# Altium schematic sheet Method.SchDoc
size A2
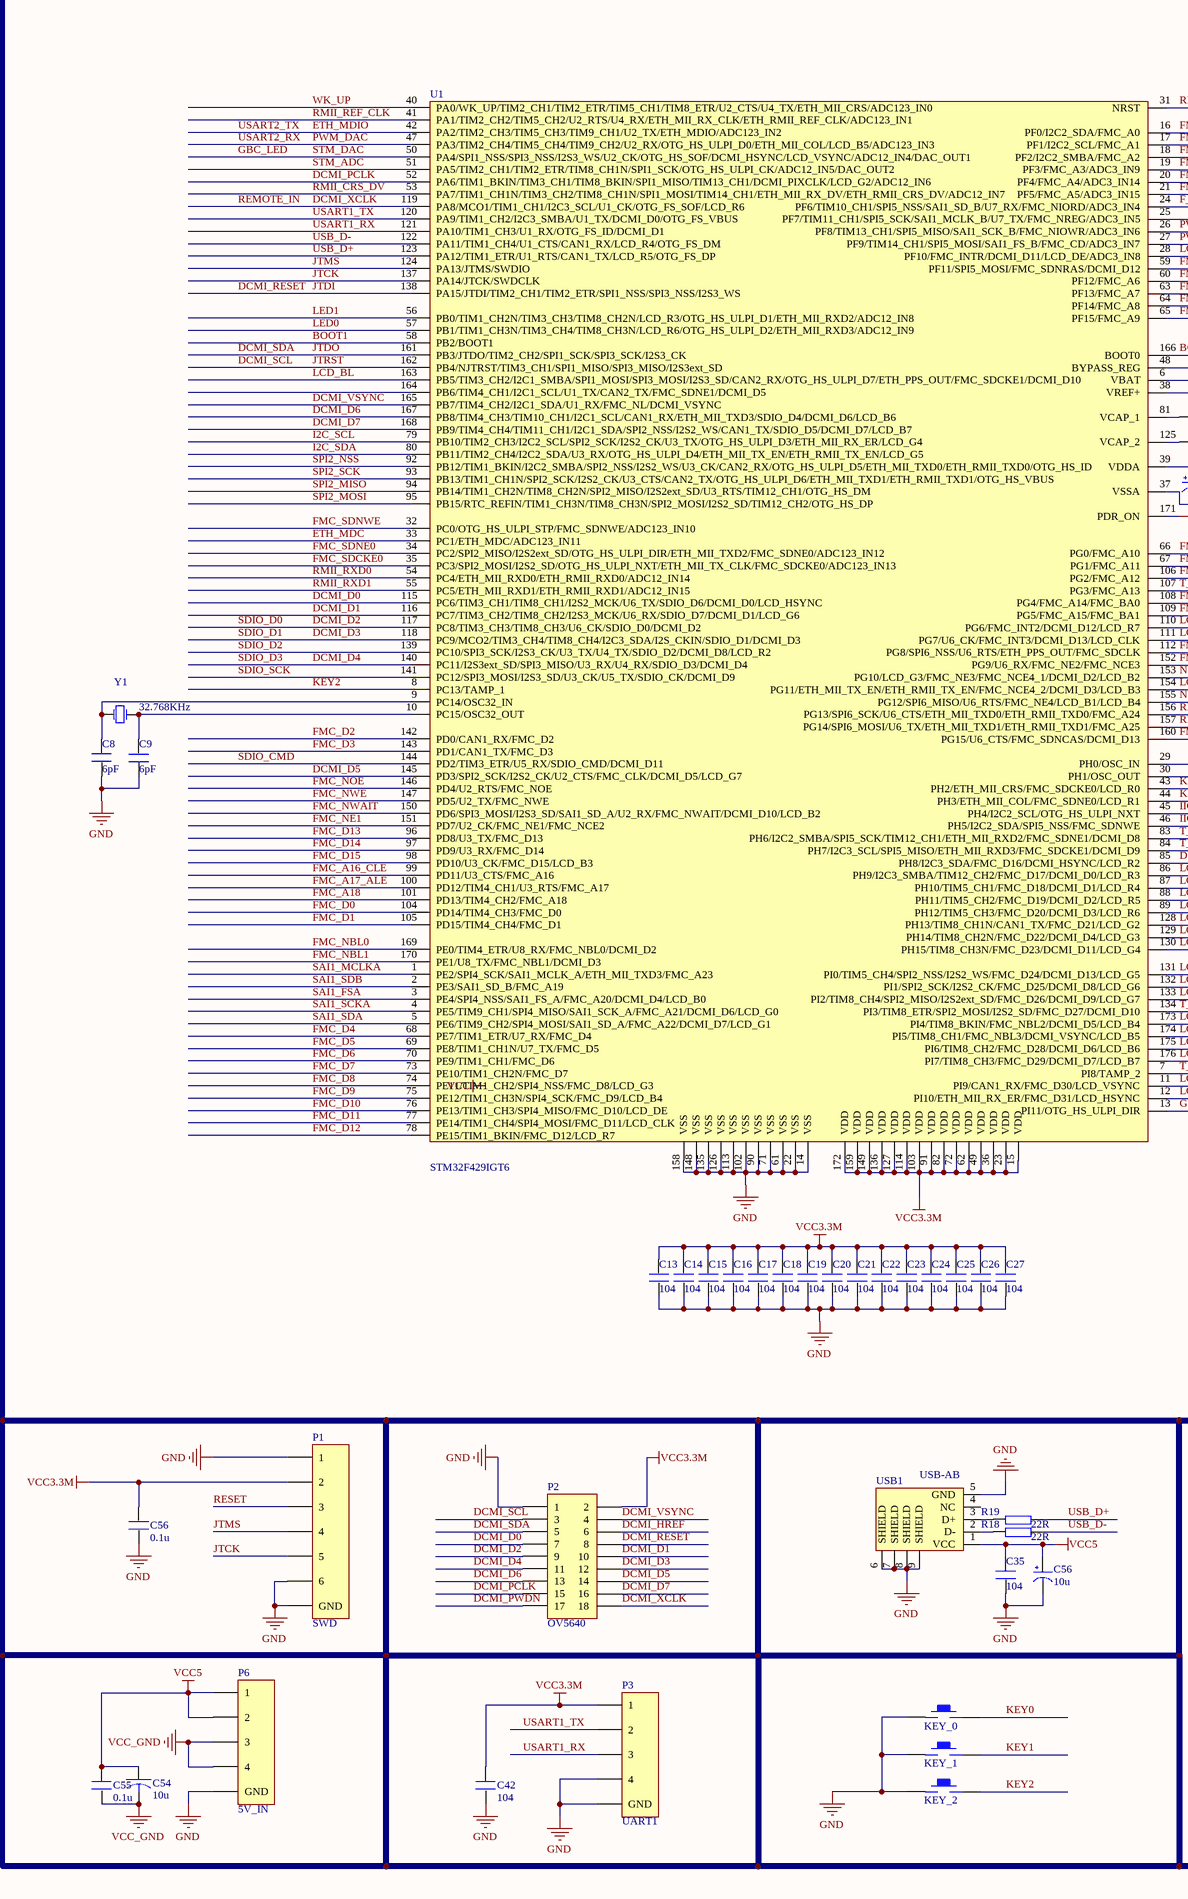
[diagram p0: Method.SchDoc, left]
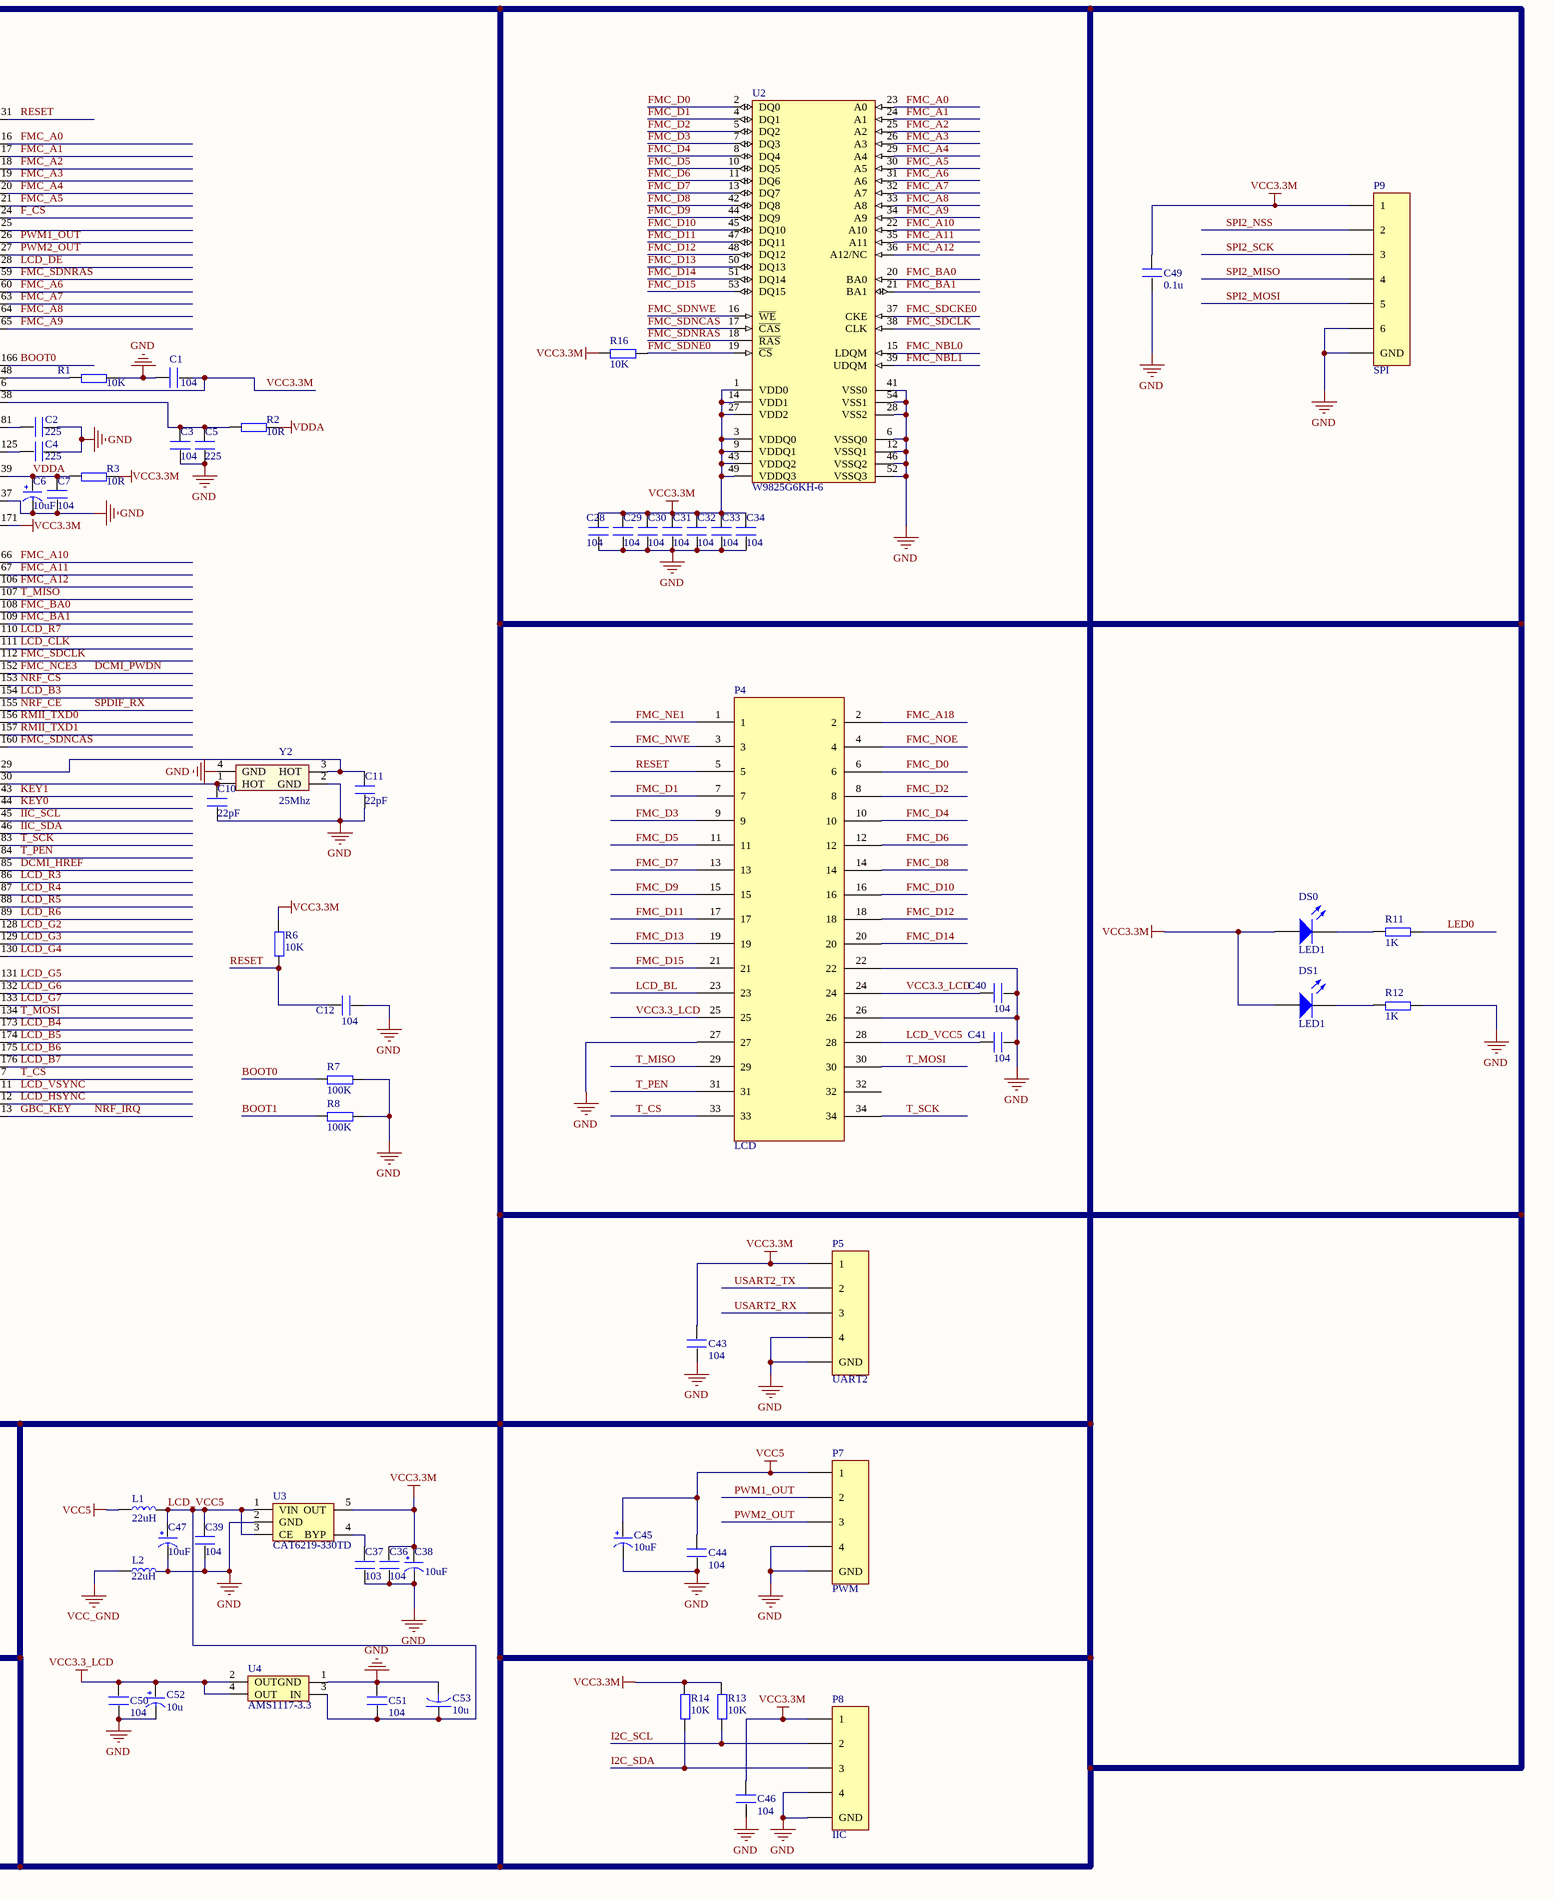
[diagram p1: Method.SchDoc, right]

## Parts
(Parts that share a designator on the sheet are numbered #1, #2 ... from top to bottom, then left to right.)
C1  104  [0603P]
C2  225  [0603P]
C3  104  [0603P]
C4  225  [0603P]
C5  225  [0603P]
C6  10uF  [CAP_D1]
C7  104  [0603P]
C8  6pF  [0603P]
C9  6pF  [0603P]
C10  22pF  [0603P]
C11  22pF  [0603P]
C12  104  [0603P]
C13  104  [0603P]
C14  104  [0603P]
C15  104  [0603P]
C16  104  [0603P]
C17  104  [0603P]
C18  104  [0603P]
C19  104  [0603P]
C20  104  [0603P]
C21  104  [0603P]
C22  104  [0603P]
C23  104  [0603P]
C24  104  [0603P]
C25  104  [0603P]
C26  104  [0603P]
C27  104  [0603P]
C28  104  [0603P]
C29  104  [0603P]
C30  104  [0603P]
C31  104  [0603P]
C32  104  [0603P]
C33  104  [0603P]
C34  104  [0603P]
C35  104  [0603P]
C36  104  [0603P]
C37  103  [0603P]
C38  10uF  [CAP_D1]
C39  104  [0603P]
C40  104  [0603P]
C41  104  [0603P]
C42  104  [0603P]
C43  104  [0603P]
C44  104  [0603P]
C45  10uF  [CAP_D1]
C46  104  [0603P]
C47  10uF  [CAP_D1]
C49  0.1u  [0603P]
C50  104  [0603P]
C51  104  [0603P]
C52  10u  [CAP_D1]
C53  10u  [CAP_D1]
C54  10u  [CAP_D1]
C55  0.1u  [0603P]
C56#1  0.1u  [0603P]
C56#2  10u  [CAP_D1]
DS0  LED1  [SMDLED]
DS1  LED1  [SMDLED]
KEY_0  KEY_M  [KEY_M]  (value not drawn)
KEY_1  KEY_M  [KEY_M]  (value not drawn)
KEY_2  KEY_M  [KEY_M]  (value not drawn)
L1  22uH  [L0805]
L2  22uH  [L0805]
P1  SWD  [FFCH6PIN]
P2  OV5640  [HDR2X9]
P3  UART1  [FFCH4PIN]
P4  LCD  [HDR2X17]
P5  UART2  [FFCH4PIN]
P6  5V_IN  [FFCH4PIN]
P7  PWM  [FFCH4PIN]
P8  IIC  [FFCH4PIN]
P9  SPI  [FFCH6PIN]
R1  10K  [0603P]
R2  10R  [0603P]
R3  10R  [0603P]
R6  10K  [0603P]
R7  100K  [0603P]
R8  100K  [0603P]
R11  1K  [0603P]
R12  1K  [0603P]
R13  10K  [0603P]
R14  10K  [0603P]
R16  10K  [0603P]
R18  22R  [0603P]
R19  22R  [0603P]
U1  STM32F429IGT6  [LQFP176]
U2  W9825G6KH-6  [TSOP54]
U3  CAT6219-330TD  [SOT-23-5]
U4  AMS1117-3.3  [AMS1117]
USB1  USB-AB  [USB_AB]
Y1  32.768KHz  [XTAL3215]
Y2  25Mhz  [XTAL3225]

## Nets
GND: C1.1 C2.1 C3.1 C4.1 C5.1 C6.2(GND) C7.1 C8.1 C9.2 C10.1 C11.1 C12.2 C13.1 C14.1 C15.1 C16.1 C17.1 C18.1 C19.1 C20.1 C21.1 C22.1 C23.1 C24.1 C25.1 C26.1 C27.1 C28.1 C29.1 C30.1 C31.1 C32.1 C33.1 C34.1 C35.1 C36.1 C37.1 C38.2(GND) C39.1 C40.2 C41.2 C42.1 C43.1 C44.1 C45.2(GND) C46.1 C47.2(GND) C49.1 C50.2 C51.1 C52.2(GND) C53.2 C56#1.1 C56#2.2(GND) KEY_0.1 KEY_1.1 KEY_2.1 L2.2 P1.0(GND) P1.1 P1.6 P2.1 P3.0(GND) P3.4 P4.22 P4.26 P4.27 P5.0(GND) P5.4 P6.0(GND) P7.0(GND) P7.4 P8.0(GND) P8.4 P9.0(GND) P9.6 R1.2 R7.2 R8.2 R12.2 U1.14(VSS) U1.22(VSS) U1.37(VSSA) U1.61(VSS) U1.71(VSS) U1.90(VSS) U1.102(VSS) U1.113(VSS) U1.126(VSS) U1.135(VSS) U1.148(VSS) U1.158(VSS) U2.6(VSSQ0) U2.12(VSSQ1) U2.28(VSS2) U2.41(VSS0) U2.46(VSSQ2) U2.52(VSSQ3) U2.54(VSS1) U3.2(GND) U4.1(GND) USB1.5(GND) USB1.6(SHIELD) USB1.7(SHIELD) USB1.8(SHIELD) USB1.9(SHIELD) Y2.2(GND) Y2.4(GND)
VCC3.3_LCD: C40.1 C50.1 C52.1(VCC) P4.24 P4.25 U4.2(OUT) U4.4(OUT)
VCC3.3M: C1.2 C13.2 C14.2 C15.2 C16.2 C17.2 C18.2 C19.2 C20.2 C21.2 C22.2 C23.2 C24.2 C25.2 C26.2 C27.2 C28.2 C29.2 C30.2 C31.2 C32.2 C33.2 C34.2 C36.2 C38.1(VCC) C42.2 C43.2 C46.2 C49.2 C56#1.2 DS0.1(A) DS1.1(A) P1.2 P2.2 P3.1 P5.1 P8.1 P9.1 R3.2 R6.2 R13.2 R14.2 R16.1 U1.6(VBAT) U1.15(VDD) U1.23(VDD) U1.36(VDD) U1.49(VDD) U1.62(VDD) U1.72(VDD) U1.82(VDD) U1.91(VDD) U1.103(VDD) U1.114(VDD) U1.127(VDD) U1.136(VDD) U1.149(VDD) U1.159(VDD) U1.171(PDR_ON) U1.172(VDD) U2.1(VDD0) U2.3(VDDQ0) U2.9(VDDQ1) U2.14(VDD1) U2.27(VDD2) U2.43(VDDQ2) U2.49(VDDQ3) U3.5(OUT)
VCC5: C35.2 C44.2 C45.1(VCC) C54.1 C55.2 C56#2.1(VCC) L1.1 P6.1 P6.2 P7.1 USB1.1(VCC)
VCC_GND: C54.2 C55.1 L2.1 P6.3 P6.4
VDDA: C6.1(VCC) C7.2 R2.2 R3.1 U1.39(VDDA)
BOOT0: R7.1 U1.166(BOOT0)
BOOT1: R8.1 U1.58(PB2/BOOT1)
DCMI_D0: P2.7 U1.115(PC6/TIM3_CH1/TIM8_CH1/I2S2_MCK/U6_TX/SDIO_D6/DCMI_D0/LCD_HSYNC)
DCMI_D1: P2.10 U1.116(PC7/TIM3_CH2/TIM8_CH2/I2S3_MCK/U6_RX/SDIO_D7/DCMI_D1/LCD_G6)
DCMI_D2: P2.9 U1.117(PC8/TIM3_CH3/TIM8_CH3/U6_CK/SDIO_D0/DCMI_D2)  [also labelled SDIO_D0]
DCMI_D3: P2.12 U1.118(PC9/MCO2/TIM3_CH4/TIM8_CH4/I2C3_SDA/I2S_CKIN/SDIO_D1/DCMI_D3)  [also labelled SDIO_D1]
DCMI_D4: P2.11 U1.140(PC11/I2S3ext_SD/SPI3_MISO/U3_RX/U4_RX/SDIO_D3/DCMI_D4)  [also labelled SDIO_D3]
DCMI_D5: P2.14 U1.145(PD3/SPI2_SCK/I2S2_CK/U2_CTS/FMC_CLK/DCMI_D5/LCD_G7)
DCMI_D6: P2.13 U1.167(PB8/TIM4_CH3/TIM10_CH1/I2C1_SCL/CAN1_RX/ETH_MII_TXD3/SDIO_D4/DCMI_D6/LCD_B6)
DCMI_D7: P2.16 U1.168(PB9/TIM4_CH4/TIM11_CH1/I2C1_SDA/SPI2_NSS/I2S2_WS/CAN1_TX/SDIO_D5/DCMI_D7/LCD_B7)
DCMI_HREF: P2.6 U1.85(PH8/I2C3_SDA/FMC_D16/DCMI_HSYNC/LCD_R2)
DCMI_PCLK: P2.15 U1.52(PA6/TIM1_BKIN/TIM3_CH1/TIM8_BKIN/SPI1_MISO/TIM13_CH1/DCMI_PIXCLK/LCD_G2/ADC12_IN6)
DCMI_PWDN: P2.17 U1.152(PG9/U6_RX/FMC_NE2/FMC_NCE3)  [also labelled FMC_NCE3]
DCMI_RESET: P2.8 U1.138(PA15/JTDI/TIM2_CH1/TIM2_ETR/SPI1_NSS/SPI3_NSS/I2S3_WS)  [also labelled JTDI]
DCMI_SCL: P2.3 U1.162(PB4/NJTRST/TIM3_CH1/SPI1_MISO/SPI3_MISO/I2S3ext_SD)  [also labelled JTRST]
DCMI_SDA: P2.5 U1.161(PB3/JTDO/TIM2_CH2/SPI1_SCK/SPI3_SCK/I2S3_CK)  [also labelled JTDO]
DCMI_VSYNC: P2.4 U1.165(PB7/TIM4_CH2/I2C1_SDA/U1_RX/FMC_NL/DCMI_VSYNC)
DCMI_XCLK: P2.18 U1.119(PA8/MCO1/TIM1_CH1/I2C3_SCL/U1_CK/OTG_FS_SOF/LCD_R6)  [also labelled REMOTE_IN]
ETH_MDC: U1.33(PC1/ETH_MDC/ADC123_IN11)
ETH_MDIO: P5.2 U1.42(PA2/TIM2_CH3/TIM5_CH3/TIM9_CH1/U2_TX/ETH_MDIO/ADC123_IN2)  [also labelled USART2_TX]
F_CS: U1.24(PF6/TIM10_CH1/SPI5_NSS/SAI1_SD_B/U7_RX/FMC_NIORD/ADC3_IN4)
FMC_A0: U1.16(PF0/I2C2_SDA/FMC_A0) U2.23(A0)
FMC_A1: U1.17(PF1/I2C2_SCL/FMC_A1) U2.24(A1)
FMC_A2: U1.18(PF2/I2C2_SMBA/FMC_A2) U2.25(A2)
FMC_A3: U1.19(PF3/FMC_A3/ADC3_IN9) U2.26(A3)
FMC_A4: U1.20(PF4/FMC_A4/ADC3_IN14) U2.29(A4)
FMC_A5: U1.21(PF5/FMC_A5/ADC3_IN15) U2.30(A5)
FMC_A6: U1.60(PF12/FMC_A6) U2.31(A6)
FMC_A7: U1.63(PF13/FMC_A7) U2.32(A7)
FMC_A8: U1.64(PF14/FMC_A8) U2.33(A8)
FMC_A9: U1.65(PF15/FMC_A9) U2.34(A9)
FMC_A10: U1.66(PG0/FMC_A10) U2.22(A10)
FMC_A11: U1.67(PG1/FMC_A11) U2.35(A11)
FMC_A12: U1.106(PG2/FMC_A12) U2.36(A12/NC)
FMC_A16_CLE: U1.99(PD11/U3_CTS/FMC_A16)
FMC_A17_ALE: U1.100(PD12/TIM4_CH1/U3_RTS/FMC_A17)
FMC_A18: P4.2 U1.101(PD13/TIM4_CH2/FMC_A18)
FMC_BA0: U1.108(PG4/FMC_A14/FMC_BA0) U2.20(BA0)
FMC_BA1: U1.109(PG5/FMC_A15/FMC_BA1) U2.21(BA1)
FMC_D0: P4.6 U1.104(PD14/TIM4_CH3/FMC_D0) U2.2(DQ0)
FMC_D1: P4.7 U1.105(PD15/TIM4_CH4/FMC_D1) U2.4(DQ1)
FMC_D2: P4.8 U1.142(PD0/CAN1_RX/FMC_D2) U2.5(DQ2)
FMC_D3: P4.9 U1.143(PD1/CAN1_TX/FMC_D3) U2.7(DQ3)
FMC_D4: P4.10 U1.68(PE7/TIM1_ETR/U7_RX/FMC_D4) U2.8(DQ4)
FMC_D5: P4.11 U1.69(PE8/TIM1_CH1N/U7_TX/FMC_D5) U2.10(DQ5)
FMC_D6: P4.12 U1.70(PE9/TIM1_CH1/FMC_D6) U2.11(DQ6)
FMC_D7: P4.13 U1.73(PE10/TIM1_CH2N/FMC_D7) U2.13(DQ7)
FMC_D8: P4.14 U1.74(PE11/TIM1_CH2/SPI4_NSS/FMC_D8/LCD_G3) U2.42(DQ8)
FMC_D9: P4.15 U1.75(PE12/TIM1_CH3N/SPI4_SCK/FMC_D9/LCD_B4) U2.44(DQ9)
FMC_D10: P4.16 U1.76(PE13/TIM1_CH3/SPI4_MISO/FMC_D10/LCD_DE) U2.45(DQ10)
FMC_D11: P4.17 U1.77(PE14/TIM1_CH4/SPI4_MOSI/FMC_D11/LCD_CLK) U2.47(DQ11)
FMC_D12: P4.18 U1.78(PE15/TIM1_BKIN/FMC_D12/LCD_R7) U2.48(DQ12)
FMC_D13: P4.19 U1.96(PD8/U3_TX/FMC_D13) U2.50(DQ13)
FMC_D14: P4.20 U1.97(PD9/U3_RX/FMC_D14) U2.51(DQ14)
FMC_D15: P4.21 U1.98(PD10/U3_CK/FMC_D15/LCD_B3) U2.53(DQ15)
FMC_NBL0: U1.169(PE0/TIM4_ETR/U8_RX/FMC_NBL0/DCMI_D2) U2.15(LDQM)
FMC_NBL1: U1.170(PE1/U8_TX/FMC_NBL1/DCMI_D3) U2.39(UDQM)
FMC_NE1: P4.1 U1.151(PD7/U2_CK/FMC_NE1/FMC_NCE2)
FMC_NOE: P4.4 U1.146(PD4/U2_RTS/FMC_NOE)
FMC_NWAIT: U1.150(PD6/SPI3_MOSI/I2S3_SD/SAI1_SD_A/U2_RX/FMC_NWAIT/DCMI_D10/LCD_B2)
FMC_NWE: P4.3 U1.147(PD5/U2_TX/FMC_NWE)
FMC_SDCKE0: U1.35(PC3/SPI2_MOSI/I2S2_SD/OTG_HS_ULPI_NXT/ETH_MII_TX_CLK/FMC_SDCKE0/ADC123_IN13) U2.37(CKE)
FMC_SDCLK: U1.112(PG8/SPI6_NSS/U6_RTS/ETH_PPS_OUT/FMC_SDCLK) U2.38(CLK)
FMC_SDNCAS: U1.160(PG15/U6_CTS/FMC_SDNCAS/DCMI_D13) U2.17(~{CAS})
FMC_SDNE0: R16.2 U1.34(PC2/SPI2_MISO/I2S2ext_SD/OTG_HS_ULPI_DIR/ETH_MII_TXD2/FMC_SDNE0/ADC123_IN12) U2.19(~{CS})
FMC_SDNRAS: U1.59(PF11/SPI5_MOSI/FMC_SDNRAS/DCMI_D12) U2.18(~{RAS})
FMC_SDNWE: U1.32(PC0/OTG_HS_ULPI_STP/FMC_SDNWE/ADC123_IN10) U2.16(~{WE})
GBC_KEY: U1.13(PI11/OTG_HS_ULPI_DIR)  [also labelled NRF_IRQ]
GBC_LED: U1.50(PA4/SPI1_NSS/SPI3_NSS/I2S3_WS/U2_CK/OTG_HS_SOF/DCMI_HSYNC/LCD_VSYNC/ADC12_IN4/DAC_OUT1)  [also labelled STM_DAC]
I2C_SCL: P8.2 R13.1 U1.79(PB10/TIM2_CH3/I2C2_SCL/SPI2_SCK/I2S2_CK/U3_TX/OTG_HS_ULPI_D3/ETH_MII_RX_ER/LCD_G4)
I2C_SDA: P8.3 R14.1 U1.80(PB11/TIM2_CH4/I2C2_SDA/U3_RX/OTG_HS_ULPI_D4/ETH_MII_TX_EN/ETH_RMII_TX_EN/LCD_G5)
IIC_SCL: U1.45(PH4/I2C2_SCL/OTG_HS_ULPI_NXT)
IIC_SDA: U1.46(PH5/I2C2_SDA/SPI5_NSS/FMC_SDNWE)
JTCK: P1.5 U1.137(PA14/JTCK/SWDCLK)
JTMS: P1.4 U1.124(PA13/JTMS/SWDIO)
KEY0: KEY_0.2 U1.44(PH3/ETH_MII_COL/FMC_SDNE0/LCD_R1)
KEY1: KEY_1.2 U1.43(PH2/ETH_MII_CRS/FMC_SDCKE0/LCD_R0)
KEY2: KEY_2.2 U1.8(PC13/TAMP_1)
LCD_B3: U1.154(PG11/ETH_MII_TX_EN/ETH_RMII_TX_EN/FMC_NCE4_2/DCMI_D3/LCD_B3)
LCD_B4: U1.173(PI4/TIM8_BKIN/FMC_NBL2/DCMI_D5/LCD_B4)
LCD_B5: U1.174(PI5/TIM8_CH1/FMC_NBL3/DCMI_VSYNC/LCD_B5)
LCD_B6: U1.175(PI6/TIM8_CH2/FMC_D28/DCMI_D6/LCD_B6)
LCD_B7: U1.176(PI7/TIM8_CH3/FMC_D29/DCMI_D7/LCD_B7)
LCD_BL: P4.23 U1.163(PB5/TIM3_CH2/I2C1_SMBA/SPI1_MOSI/SPI3_MOSI/I2S3_SD/CAN2_RX/OTG_HS_ULPI_D7/ETH_PPS_OUT/FMC_SDCKE1/DCMI_D10)
LCD_CLK: U1.111(PG7/U6_CK/FMC_INT3/DCMI_D13/LCD_CLK)
LCD_DE: U1.28(PF10/FMC_INTR/DCMI_D11/LCD_DE/ADC3_IN8)
LCD_G2: U1.128(PH13/TIM8_CH1N/CAN1_TX/FMC_D21/LCD_G2)
LCD_G3: U1.129(PH14/TIM8_CH2N/FMC_D22/DCMI_D4/LCD_G3)
LCD_G4: U1.130(PH15/TIM8_CH3N/FMC_D23/DCMI_D11/LCD_G4)
LCD_G5: U1.131(PI0/TIM5_CH4/SPI2_NSS/I2S2_WS/FMC_D24/DCMI_D13/LCD_G5)
LCD_G6: U1.132(PI1/SPI2_SCK/I2S2_CK/FMC_D25/DCMI_D8/LCD_G6)
LCD_G7: U1.133(PI2/TIM8_CH4/SPI2_MISO/I2S2ext_SD/FMC_D26/DCMI_D9/LCD_G7)
LCD_HSYNC: U1.12(PI10/ETH_MII_RX_ER/FMC_D31/LCD_HSYNC)
LCD_R3: U1.86(PH9/I2C3_SMBA/TIM12_CH2/FMC_D17/DCMI_D0/LCD_R3)
LCD_R4: U1.87(PH10/TIM5_CH1/FMC_D18/DCMI_D1/LCD_R4)
LCD_R5: U1.88(PH11/TIM5_CH2/FMC_D19/DCMI_D2/LCD_R5)
LCD_R6: U1.89(PH12/TIM5_CH3/FMC_D20/DCMI_D3/LCD_R6)
LCD_R7: U1.110(PG6/FMC_INT2/DCMI_D12/LCD_R7)
LCD_VCC5: C39.2 C41.1 C47.1(VCC) C51.2 C53.1 L1.2 P4.28 U3.1(VIN) U3.3(CE) U4.3(IN)
LCD_VSYNC: U1.11(PI9/CAN1_RX/FMC_D30/LCD_VSYNC)
LED0: R11.2 U1.57(PB1/TIM1_CH3N/TIM3_CH4/TIM8_CH3N/LCD_R6/OTG_HS_ULPI_D2/ETH_MII_RXD3/ADC12_IN9)
LED1: U1.56(PB0/TIM1_CH2N/TIM3_CH3/TIM8_CH2N/LCD_R3/OTG_HS_ULPI_D1/ETH_MII_RXD2/ADC12_IN8)
NRF_CE: U1.155(PG12/SPI6_MISO/U6_RTS/FMC_NE4/LCD_B1/LCD_B4)  [also labelled SPDIF_RX]
NRF_CS: U1.153(PG10/LCD_G3/FMC_NE3/FMC_NCE4_1/DCMI_D2/LCD_B2)
PWM1_OUT: P7.2 U1.26(PF8/TIM13_CH1/SPI5_MISO/SAI1_SCK_B/FMC_NIOWR/ADC3_IN6)
PWM2_OUT: P7.3 U1.27(PF9/TIM14_CH1/SPI5_MOSI/SAI1_FS_B/FMC_CD/ADC3_IN7)
PWM_DAC: P5.3 U1.47(PA3/TIM2_CH4/TIM5_CH4/TIM9_CH2/U2_RX/OTG_HS_ULPI_D0/ETH_MII_COL/LCD_B5/ADC123_IN3)  [also labelled USART2_RX]
RESET: C12.1 P1.3 P4.5 R6.1 U1.31(NRST)
RMII_CRS_DV: U1.53(PA7/TIM1_CH1N/TIM3_CH2/TIM8_CH1N/SPI1_MOSI/TIM14_CH1/ETH_MII_RX_DV/ETH_RMII_CRS_DV/ADC12_IN7)
RMII_REF_CLK: U1.41(PA1/TIM2_CH2/TIM5_CH2/U2_RTS/U4_RX/ETH_MII_RX_CLK/ETH_RMII_REF_CLK/ADC123_IN1)
RMII_RXD0: U1.54(PC4/ETH_MII_RXD0/ETH_RMII_RXD0/ADC12_IN14)
RMII_RXD1: U1.55(PC5/ETH_MII_RXD1/ETH_RMII_RXD1/ADC12_IN15)
RMII_TXD0: U1.156(PG13/SPI6_SCK/U6_CTS/ETH_MII_TXD0/ETH_RMII_TXD0/FMC_A24)
RMII_TXD1: U1.157(PG14/SPI6_MOSI/U6_TX/ETH_MII_TXD1/ETH_RMII_TXD1/FMC_A25)
SAI1_FSA: U1.3(PE4/SPI4_NSS/SAI1_FS_A/FMC_A20/DCMI_D4/LCD_B0)
SAI1_MCLKA: U1.1(PE2/SPI4_SCK/SAI1_MCLK_A/ETH_MII_TXD3/FMC_A23)
SAI1_SCKA: U1.4(PE5/TIM9_CH1/SPI4_MISO/SAI1_SCK_A/FMC_A21/DCMI_D6/LCD_G0)
SAI1_SDA: U1.5(PE6/TIM9_CH2/SPI4_MOSI/SAI1_SD_A/FMC_A22/DCMI_D7/LCD_G1)
SAI1_SDB: U1.2(PE3/SAI1_SD_B/FMC_A19)
SDIO_CMD: U1.144(PD2/TIM3_ETR/U5_RX/SDIO_CMD/DCMI_D11)
SDIO_D2: U1.139(PC10/SPI3_SCK/I2S3_CK/U3_TX/U4_TX/SDIO_D2/DCMI_D8/LCD_R2)
SDIO_SCK: U1.141(PC12/SPI3_MOSI/I2S3_SD/U3_CK/U5_TX/SDIO_CK/DCMI_D9)
SPI2_MISO: P9.4 U1.94(PB14/TIM1_CH2N/TIM8_CH2N/SPI2_MISO/I2S2ext_SD/U3_RTS/TIM12_CH1/OTG_HS_DM)
SPI2_MOSI: P9.5 U1.95(PB15/RTC_REFIN/TIM1_CH3N/TIM8_CH3N/SPI2_MOSI/I2S2_SD/TIM12_CH2/OTG_HS_DP)
SPI2_NSS: P9.2 U1.92(PB12/TIM1_BKIN/I2C2_SMBA/SPI2_NSS/I2S2_WS/U3_CK/CAN2_RX/OTG_HS_ULPI_D5/ETH_MII_TXD0/ETH_RMII_TXD0/OTG_HS_ID)
SPI2_SCK: P9.3 U1.93(PB13/TIM1_CH1N/SPI2_SCK/I2S2_CK/U3_CTS/CAN2_TX/OTG_HS_ULPI_D6/ETH_MII_TXD1/ETH_RMII_TXD1/OTG_HS_VBUS)
STM_ADC: U1.51(PA5/TIM2_CH1/TIM2_ETR/TIM8_CH1N/SPI1_SCK/OTG_HS_ULPI_CK/ADC12_IN5/DAC_OUT2)
T_CS: P4.33 U1.7(PI8/TAMP_2)
T_MISO: P4.29 U1.107(PG3/FMC_A13)
T_MOSI: P4.30 U1.134(PI3/TIM8_ETR/SPI2_MOSI/I2S2_SD/FMC_D27/DCMI_D10)
T_PEN: P4.31 U1.84(PH7/I2C3_SCL/SPI5_MISO/ETH_MII_RXD3/FMC_SDCKE1/DCMI_D9)
T_SCK: P4.34 U1.83(PH6/I2C2_SMBA/SPI5_SCK/TIM12_CH1/ETH_MII_RXD2/FMC_SDNE1/DCMI_D8)
USART1_RX: P3.3 U1.121(PA10/TIM1_CH3/U1_RX/OTG_FS_ID/DCMI_D1)
USART1_TX: P3.2 U1.120(PA9/TIM1_CH2/I2C3_SMBA/U1_TX/DCMI_D0/OTG_FS_VBUS)
USB_D+: R19.2 U1.123(PA12/TIM1_ETR/U1_RTS/CAN1_TX/LCD_R5/OTG_FS_DP)
USB_D-: R18.2 U1.122(PA11/TIM1_CH4/U1_CTS/CAN1_RX/LCD_R4/OTG_FS_DM)
WK_UP: U1.40(PA0/WK_UP/TIM2_CH1/TIM2_ETR/TIM5_CH1/TIM8_ETR/U2_CTS/U4_TX/ETH_MII_CRS/ADC123_IN0)
NetC2_2: C2.2 U1.81(VCAP_1)
NetC3_2: C3.2 C5.2 R2.1 U1.38(VREF+)
NetC4_2: C4.2 U1.125(VCAP_2)
NetC8_2: C8.2 U1.9(PC14/OSC32_IN) Y1.1(OSC1)
NetC9_1: C9.1 U1.10(PC15/OSC32_OUT) Y1.2(OSC2)
NetC10_2: C10.2 U1.30(PH1/OSC_OUT) Y2.1(HOT)
NetC11_2: C11.2 U1.29(PH0/OSC_IN) Y2.3(HOT)
NetC37_2: C37.2 U3.4(BYP)
NetDS0_2: DS0.2(K) R11.1
NetDS1_2: DS1.2(K) R12.1
NetR1_1: R1.1 U1.48(BYPASS_REG)
NetR18_1: R18.1 USB1.2(D-)
NetR19_1: R19.1 USB1.3(D+)

Not connected (* = marked no-connect by the designer): P4 32; U1 25(PF7/TIM11_CH1/SPI5_SCK/SAI1_MCLK_B/U7_TX/FMC_NREG/ADC3_IN5) 164(PB6/TIM4_CH1/I2C1_SCL/U1_TX/CAN2_TX/FMC_SDNE1/DCMI_D5); USB1 4(NC)

## Notes on the sheet
- Labels drawn without touching a wire or pin: VCC

## Library data of the parts
C1-C5 C7-C37 C39-C44 C46 C49-C51 C55 C56#1 = C
C6 C38 C45 C47 C52 C56#2 = CAP
C53 C54 = CAPACITOR
DS0 DS1 = LED2: Typical RED, GREEN, YELLOW, AMBER GaAs LED; Published: 8-Jun-2000; LatestRevisionDate: 17-Jul-2002; LatestRevisionNote: Re-released for DXP Platform.; PackageDocument: Feb-2002; PackageReference: 3.2X1.6X1.1; Publisher: Altium Limited
L1 L2 = L0805
P1 P9 = FFCH6
P2 = Header 9X2: Header, 9-Pin, Dual row; LatestRevisionDate: 17-Jul-2002; LatestRevisionNote: Re-released for DXP Platform.; Publisher: Altium Limited
P3 P5-P8 = FFCH4
P4 = Component_2
R1-R3 R6-R8 R11-R14 R16 R18 R19 = R
U2 = IS42S16160B: 32MB SDRAM
U3 = CAT6219-330TD: 3.3V 500mA LDO
U4 = AMS1117: pin to pad: 1>3 3>1
USB1 = USB-AB: MicroUSB
Y1 = XTAL: 普通晶振; Published: 8-Jun-2000; LatestRevisionDate: 17-Jul-2002; LatestRevisionNote: Re-released for DXP Platform.; Publisher: Altium Limited
Y2 = XTAL_3225: 3225贴片无源晶振